# Altium schematic sheet Buck Converter_12v.SchDoc
size A
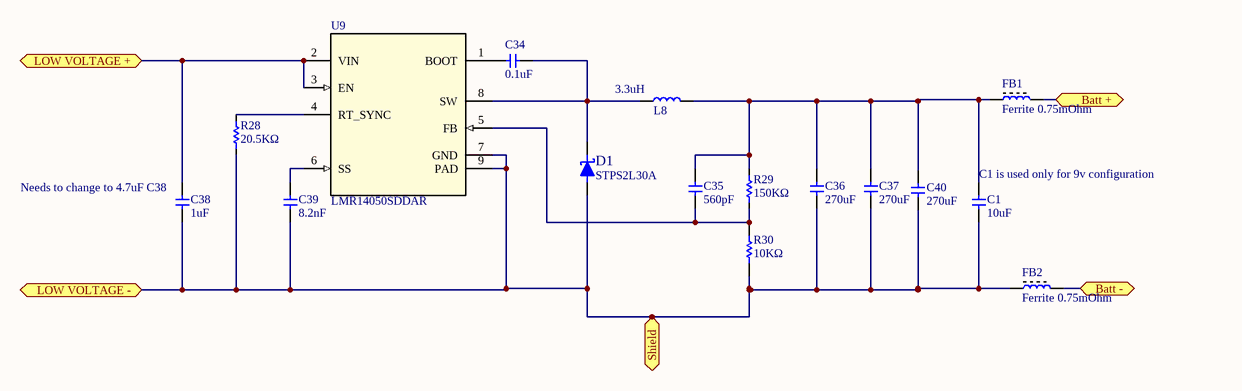
[diagram p0: Buck Converter_12v.SchDoc]

## Parts
C1  10uF  [0805 capacitor]
C34  0.1uF  [0805 capacitor]
C35  560pF  [0603 Capacitor]
C36  270uF  [APXG160ARA271MH70G]
C37  270uF  [APXG160ARA271MH70G]
C38  1uF  [1206 - duplicate]
C39  8.2nF  [0402 Small]
C40  270uF  [APXG160ARA271MH70G]
D1  STPS2L30A  [SMC]
FB1  Ferrite 0.75mOhm  [2-SMD, J-LEAD]
FB2  Ferrite 0.75mOhm  [2-SMD, J-LEAD]
L8  3.3uH  [SRN8040 - Power Inductor]
R28  20.5KΩ  [0603]
R29  150KΩ  [0603 resistor]
R30  10KΩ  [0805]
U9  LMR14050SDDAR  [SO8 - GROUND PAD]

## Ports
Batt +, Batt -, LOW VOLTAGE +, LOW VOLTAGE -, Shield

## Nets
Batt +: FB1.2 ; port Batt +
Batt -: FB2.2 ; port Batt -
LOW VOLTAGE +: C38.1 U9.2(VIN) U9.3(EN) ; port LOW VOLTAGE +
LOW VOLTAGE -: C1.2 C36.2 C37.2 C38.2 C39.2 C40.2 D1.1(A) FB2.1 R28.1 R30.1 U9.7(GND) U9.9(PAD) ; port LOW VOLTAGE -, port Shield
NetC1_1: C1.1 C35.1 C36.1 C37.1 C40.1 FB1.1 L8.2 R29.2
NetC34_1: C34.1 D1.2(K) L8.1 U9.8(SW)
NetC34_2: C34.2 U9.1(BOOT)
NetC35_2: C35.2 R29.1 R30.2 U9.5(FB)
NetC39_1: C39.1 U9.6(SS)
NetR28_2: R28.2 U9.4(RT_SYNC)

## Notes on the sheet
- (near C38) Needs to change to 4.7uF C38
- (near C1) C1 is used only for 9v configuration

## Library data of the parts
C1 = Cap: 10µF ±10% 16V Ceramic Capacitor X5R 0805 (2012 Metric); Manufacturer: Murata Electronics North America; Manufacturer#: GRM21BR61C106KE15L; Cost: .03964
C34 = Cap: CAP CER 0.1UF 50V 10% X7R 0603; Manufacturer: KEMET; Manufacturer#: C0805C104K5RACTU; Cost: 0.0033
C35 = Cap: CAP CER 560PF 25V X7R 0201; Manufacturer: Murata Electronics North America; Manufacturer#: GRM033R71E561KA01D; Cost: 0.0015
C36 C37 C40 = Cap: CAP ALUM POLY 270UF 20% 16V SMD; Manufacturer: United Chemi-Con; Cost: 0.37433; Manufacturer#: APXG160ARA271MH70G
C38 = Cap: 1µF ±10% 50V Ceramic Capacitor X7R 0805 (2012 Metric); Manufacturer: Samsung Electro-Mechanics America, Inc.; Manufacturer#: CL21B105KBFNNNE; Cost: 0.04379
C39 = Cap: 8200pF ±10% 16V Ceramic Capacitor X7R 0402 (1005 Metric); Manufacturer: Murata Electronics North America; Manufacturer#: GRM155R71C822KA01D; Cost: 0.0052
D1 = DIODE_SCHOTTKY: DIODE SCHOTTKY 30V 2A SMA; Manufacturer#: B540C-13-F; Manufacturer: STMICROELECTRONICS; Cost: 0.1299
FB1 FB2 = Ferrite Bead: FERRITE BEAD 48 OHM 2SMD 1LN; Manufacturer: Laird-Signal Integrity Products; Manufacturer#: 28F0121-0SR-10; Cost: 0.06261
L8 = Inductor: Fixed Inductors XAL5030 High Current 3.3 uH 20 % 8.1 A; Manufacturer#: XAL5030-332MEB; Manufacturer: Coilcraft; Cost: 0.56
R28 = Resistor: 20.5k Ohm ±1% 0.1W, 1/10W Chip Resistor 0603 (1608 Metric) Automotive AEC-Q200 Thick Film; Manufacturer: Panasonic Electronic Components; Manufacturer#: ERJ-3EKF2052V; Cost: 0.0176
R29 = Resistor: RES SMD 150K OHM 1% 1/16W 0402; Manufacturer: Vishay Dale; Manufacturer#: CRCW0402150KFKED; Cost: 0.00670
R30 = Res1: RES SMD 10K OHM 1% 1/8W 0805; Manufacturer: Panasonic Electronic Components; Manufacturer#: ERJ-6ENF1002V; Cost: 0.00749
U9 = LMR14050SDDAR: Buck Switching Regulator IC Positive Adjustable 0.8V 1 Output 5A 8-PowerSOIC (0.154", 3.90mm Width); Manufacturer: Texas Instruments; PIN_COUNT: 9; Application_BuildNumber: *; PartNumber: LMR14050SDDAR; PackageReference: DDA0008E; MountType: SMT; CompType: IC; RoHS: Y; RefDes: RefDes; Type: DEV; Value: Value; Manufacturer_Part_Number: LMR14050SDDAR; Manufacturer_Name: Texas Instruments; Alternate_PartNumber: LMR14050SDDA; Manufacturer#: LMR14050SDDA; Cost: 2.9484